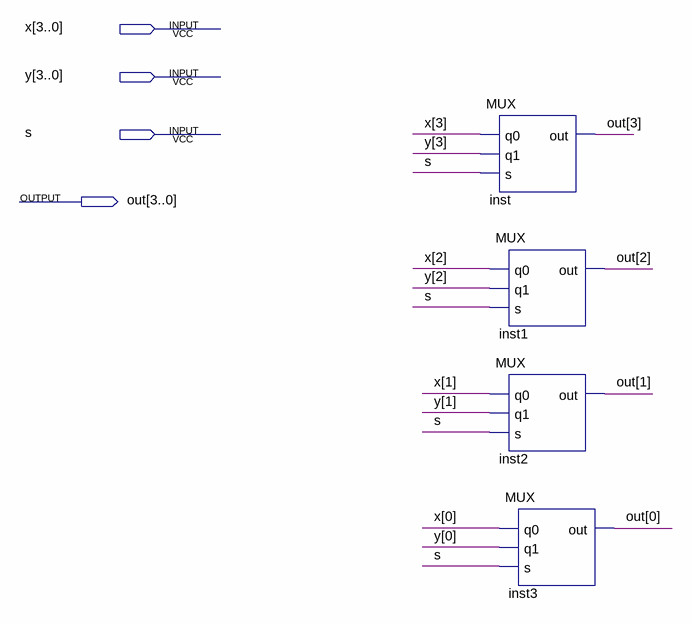
[diagram p0: schematic sheet]
// Quartus schematic fourBitMUX.bdf as structural Verilog: 4 symbols, 4 pins
module fourBitMUX (
  input  [3:0] x,
  input  [3:0] y,
  input  s,
  output [3:0] out
);

  MUX inst (.q0(x[3]), .q1(y[3]), .s(s), .out(out[3]));
  MUX inst1 (.q0(x[2]), .q1(y[2]), .s(s), .out(out[2]));
  MUX inst2 (.q0(x[1]), .q1(y[1]), .s(s), .out(out[1]));
  MUX inst3 (.q0(x[0]), .q1(y[0]), .s(s), .out(out[0]));
endmodule
